# EAGLE design Mux_Shield (EAGLE 9.6.2)
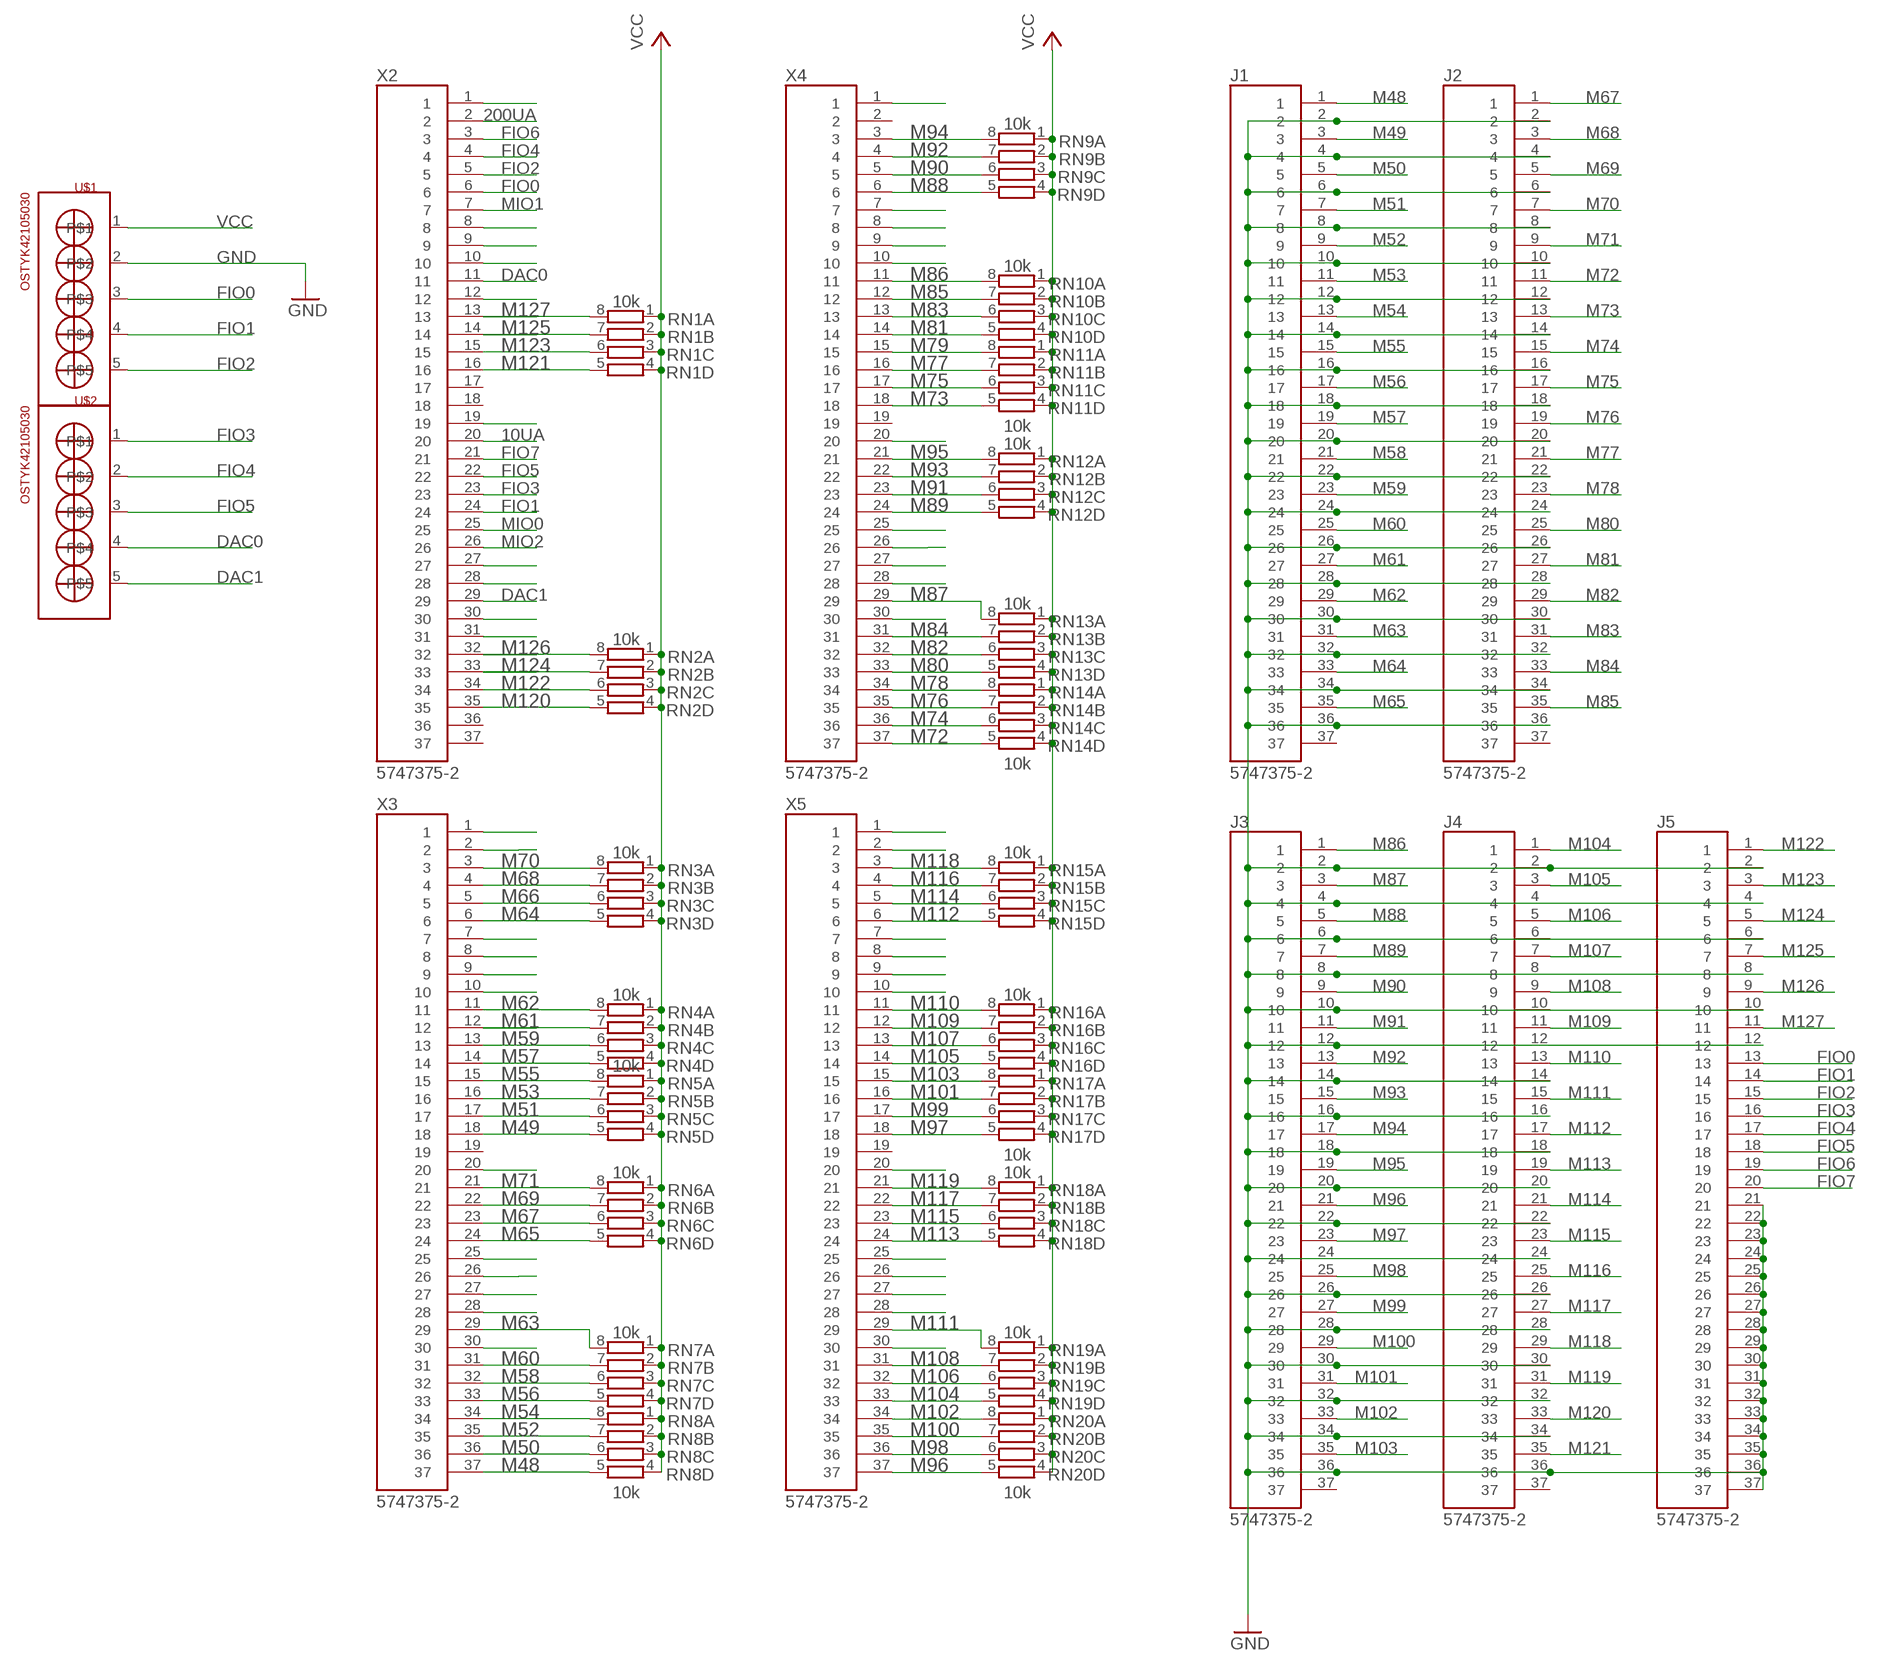
[diagram p0: schematic, sheet 1]

## Parts
J1  5747375-2  [TE_5747375-2]
J2  5747375-2  [TE_5747375-2]
J3  5747375-2  [TE_5747375-2]
J4  5747375-2  [TE_5747375-2]
J5  5747375-2  [TE_5747375-2]
RN1  10k  0016_064R_10K_/_CAY16-103J4LF  [CAY16]
RN2  10k  0016_064R_10K_/_CAY16-103J4LF  [CAY16]
RN3  10k  0016_064R_10K_/_CAY16-103J4LF  [CAY16]
RN4  10k  0016_064R_10K_/_CAY16-103J4LF  [CAY16]
RN5  10k  0016_064R_10K_/_CAY16-103J4LF  [CAY16]
RN6  10k  0016_064R_10K_/_CAY16-103J4LF  [CAY16]
RN7  10k  0016_064R_10K_/_CAY16-103J4LF  [CAY16]
RN8  10k  0016_064R_10K_/_CAY16-103J4LF  [CAY16]
RN9  10k  0016_064R_10K_/_CAY16-103J4LF  [CAY16]
RN10  10k  0016_064R_10K_/_CAY16-103J4LF  [CAY16]
RN11  10k  0016_064R_10K_/_CAY16-103J4LF  [CAY16]
RN12  10k  0016_064R_10K_/_CAY16-103J4LF  [CAY16]
RN13  10k  0016_064R_10K_/_CAY16-103J4LF  [CAY16]
RN14  10k  0016_064R_10K_/_CAY16-103J4LF  [CAY16]
RN15  10k  0016_064R_10K_/_CAY16-103J4LF  [CAY16]
RN16  10k  0016_064R_10K_/_CAY16-103J4LF  [CAY16]
RN17  10k  0016_064R_10K_/_CAY16-103J4LF  [CAY16]
RN18  10k  0016_064R_10K_/_CAY16-103J4LF  [CAY16]
RN19  10k  0016_064R_10K_/_CAY16-103J4LF  [CAY16]
RN20  10k  0016_064R_10K_/_CAY16-103J4LF  [CAY16]
U$1  OSTYK42105030  [OSTYK42105030]
U$2  OSTYK42105030  [OSTYK42105030]
X2  5747375-2  [TE_5747375-2]
X3  5747375-2  [TE_5747375-2]
X4  5747375-2  [TE_5747375-2]
X5  5747375-2  [TE_5747375-2]

## Nets
10UA: X2.20
200UA: X2.2
DAC0: U$2.4 X2.11
DAC1: U$2.5 X2.29
FIO0: J5.13 U$1.3 X2.6
FIO1: J5.14 U$1.4 X2.24
FIO2: J5.15 U$1.5 X2.5
FIO3: J5.16 U$2.1 X2.23
FIO4: J5.17 U$2.2 X2.4
FIO5: J5.18 U$2.3 X2.22
FIO6: J5.19 X2.3
FIO7: J5.20 X2.21
GND: J1.2 J1.4 J1.6 J1.8 J1.10 J1.12 J1.14 J1.16 J1.18 J1.20 J1.22 J1.24 J1.26 J1.28 J1.30 J1.32 J1.34 J1.36 J2.2 J2.4 J2.6 J2.8 J2.10 J2.12 J2.14 J2.16 J2.18 J2.20 J2.22 J2.24 J2.26 J2.28 J2.30 J2.32 J2.34 J2.36 J3.2 J3.4 J3.6 J3.8 J3.10 J3.12 J3.14 J3.16 J3.18 J3.20 J3.22 J3.24 J3.26 J3.28 J3.30 J3.32 J3.34 J3.36 J4.2 J4.4 J4.6 J4.8 J4.10 J4.12 J4.14 J4.16 J4.18 J4.20 J4.22 J4.24 J4.26 J4.28 J4.30 J4.32 J4.34 J4.36 J5.2 J5.4 J5.6 J5.8 J5.10 J5.12 J5.21 J5.22 J5.23 J5.24 J5.25 J5.26 J5.27 J5.28 J5.29 J5.30 J5.31 J5.32 J5.33 J5.34 J5.35 J5.36 J5.37 U$1.2
M48: J1.1 RN8.5 X3.37
M49: J1.3 RN5.5 X3.18
M50: J1.5 RN8.6 X3.36
M51: J1.7 RN5.6 X3.17
M52: J1.9 RN8.7 X3.35
M53: J1.11 RN5.7 X3.16
M54: J1.13 RN8.8 X3.34
M55: J1.15 RN5.8 X3.15
M56: J1.17 RN7.5 X3.33
M57: J1.19 RN4.5 X3.14
M58: J1.21 RN7.6 X3.32
M59: J1.23 RN4.6 X3.13
M60: J1.25 RN7.7 X3.31
M61: J1.27 RN4.7 X3.12
M62: RN4.8 X3.11
M63: J1.31 RN7.8 X3.29
M64: J1.33 RN3.5 X3.6
M65: J1.35 RN6.5 X3.24
M66: RN3.6 X3.5
M67: J2.1 RN6.6 X3.23
M68: J2.3 RN3.7 X3.4
M69: J2.5 RN6.7 X3.22
M70: J2.7 RN3.8 X3.3
M71: J2.9 RN6.8 X3.21
M72: J2.11 RN14.5 X4.37
M73: J2.13 RN11.5 X4.18
M74: J2.15 RN14.6 X4.36
M75: J2.17 RN11.6 X4.17
M76: J2.19 RN14.7 X4.35
M77: J2.21 RN11.7 X4.16
M78: J2.23 RN14.8 X4.34
M79: RN11.8 X4.15
M80: J2.25 RN13.5 X4.33
M81: J2.27 RN10.5 X4.14
M82: J2.29 RN13.6 X4.32
M83: J2.31 RN10.6 X4.13
M84: J2.33 RN13.7 X4.31
M85: J2.35 RN10.7 X4.12
M86: J3.1 RN10.8 X4.11
M87: J3.3 RN13.8 X4.29
M88: J3.5 RN9.5 X4.6
M89: J3.7 RN12.5 X4.24
M90: RN9.6 X4.5
M91: J3.11 RN12.6 X4.23
M92: J3.13 RN9.7 X4.4
M93: J3.15 RN12.7 X4.22
M94: J3.17 RN9.8 X4.3
M95: J3.19 RN12.8 X4.21
M96: J3.21 RN20.5 X5.37
M97: J3.23 RN17.5 X5.18
M98: J3.25 RN20.6 X5.36
M99: J3.27 RN17.6 X5.17
M100: J3.29 RN20.7 X5.35
M101: J3.31 RN17.7 X5.16
M102: J3.33 RN20.8 X5.34
M103: J3.35 RN17.8 X5.15
M104: J4.1 RN19.5 X5.33
M105: J4.3 RN16.5 X5.14
M106: J4.5 RN19.6 X5.32
M107: J4.7 RN16.6 X5.13
M108: J4.9 RN19.7 X5.31
M109: J4.11 RN16.7 X5.12
M110: J4.13 RN16.8 X5.11
M111: J4.15 RN19.8 X5.29
M112: J4.17 RN15.5 X5.6
M113: J4.19 RN18.5 X5.24
M114: J4.21 RN15.6 X5.5
M115: J4.23 RN18.6 X5.23
M116: J4.25 RN15.7 X5.4
M117: J4.27 RN18.7 X5.22
M118: RN15.8 X5.3
M119: J4.31 RN18.8 X5.21
M120: J4.33 RN2.5 X2.35
M121: J4.35 RN1.5 X2.16
M122: J5.1 RN2.6 X2.34
M123: J5.3 RN1.6 X2.15
M124: J5.5 RN2.7 X2.33
M125: J5.7 RN1.7 X2.14
M126: J5.9 RN2.8 X2.32
M127: J5.11 RN1.8 X2.13
MIO0: X2.25
MIO1: X2.7
MIO2: X2.26
N$1: X4.30
N$8: X3.30
N$10: X3.28
N$11: X3.27
N$12: X3.26
N$13: X3.25
N$18: X3.20
N$30: X3.10
N$31: X3.9
N$32: X3.8
N$33: X3.7
N$38: X3.2
N$39: X3.1
N$45: X2.31
N$46: X2.30
N$48: X2.28
N$49: X2.27
N$57: X2.19
N$63: X2.12
N$66: X2.10
N$67: X2.9
N$68: X2.8
N$74: J1.29
N$75: X2.1
N$85: J3.9
N$86: X4.28
N$87: X4.27
N$88: X4.26
N$89: X4.25
N$94: X4.20
N$104: X4.10
N$105: X4.9
N$106: X4.8
N$107: X4.7
N$113: X4.1
N$122: X5.30
N$124: X5.28
N$125: X5.27
N$126: X5.26
N$127: X5.25
N$131: J4.29
N$132: X5.20
N$142: X5.10
N$143: X5.9
N$144: X5.8
N$145: X5.7
N$150: X5.2
N$151: X5.1
VCC: RN1.1 RN1.2 RN1.3 RN1.4 RN2.1 RN2.2 RN2.3 RN2.4 RN3.1 RN3.2 RN3.3 RN3.4 RN4.1 RN4.2 RN4.3 RN4.4 RN5.1 RN5.2 RN5.3 RN5.4 RN6.1 RN6.2 RN6.3 RN6.4 RN7.1 RN7.2 RN7.3 RN7.4 RN8.1 RN8.2 RN8.3 RN8.4 RN9.1 RN9.2 RN9.3 RN9.4 RN10.1 RN10.2 RN10.3 RN10.4 RN11.1 RN11.2 RN11.3 RN11.4 RN12.1 RN12.2 RN12.3 RN12.4 RN13.1 RN13.2 RN13.3 RN13.4 RN14.1 RN14.2 RN14.3 RN14.4 RN15.1 RN15.2 RN15.3 RN15.4 RN16.1 RN16.2 RN16.3 RN16.4 RN17.1 RN17.2 RN17.3 RN17.4 RN18.1 RN18.2 RN18.3 RN18.4 RN19.1 RN19.2 RN19.3 RN19.4 RN20.1 RN20.2 RN20.3 RN20.4 U$1.1
Unconnected: J1.37 J2.37 J3.37 J4.37 X2.17 X2.18 X2.36 X2.37 X3.19 X4.2 X4.19 X5.19

## Library data of the parts
J1-J5 X2-X5 = db37:5747375-2: onn D-Subminiature PIN 37 POS 2.77mm Solder ST Thru-Hole 37 Terminal 1 Port Tube; COMMENT: 5747375-2; DESCRIPTION: D-SUB pin strip 180 ° Number of pins: 37 Print TE Connectivity AMPLIMITE HD-20 1 pc(s); DIGI-KEY_PART_NUMBER: A34071-ND; EU_ROHS_COMPLIANCE: Compliant; MF: TE Connectivity; MP: 5747375-2; PACKAGE: None; PURCHASE-URL: https://pricing.snapeda.com/search/part/5747375-2/?ref=eda
RN1-RN20 = Resistenze:0016_064R_10K_/_CAY16-103J4LF: 10K 064 R; CASE: SMD_3,2x1,6; MONTHLY_USAGE: _____; PART_NUMBER: 064R_10K_/_CAY16-103J4LF; PRICE: _____; SUPPLIER: _____; TYPE: Resistenze
U$1 U$2 = OSTYK42105030:OSTYK42105030: Check availability <https://pricing.snapeda.com/parts/OSTYK42105030/On%20Shore%20Technology%20Inc./view-part?ref=eda>; AVAILABILITY: In Stock; DESCRIPTION: 5 Circuit 0.325 (8.26mm) Barrier Block Connector, Screws with Captive Plate; MF: On Shore Technology Inc.; MP: OSTYK42105030; PACKAGE: None; PRICE: None; PURCHASE-URL: https://pricing.snapeda.com/search/part/OSTYK42105030/?ref=eda

## Board
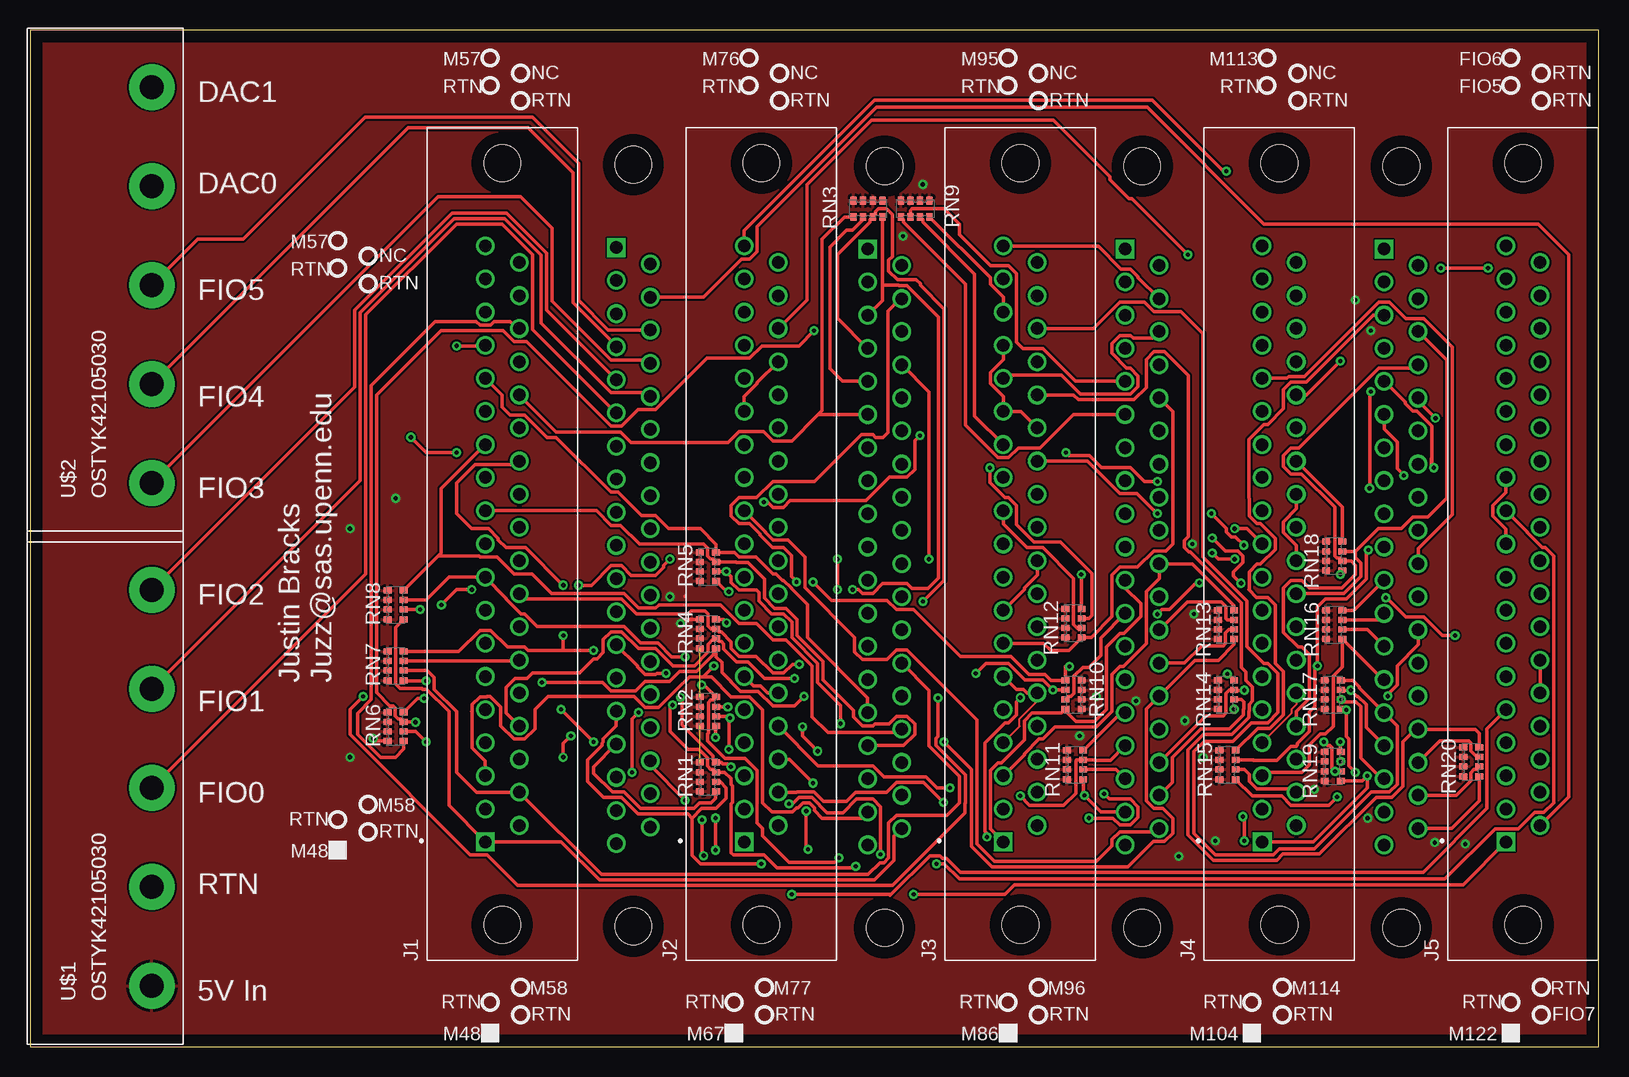
[diagram p1: board, top side]
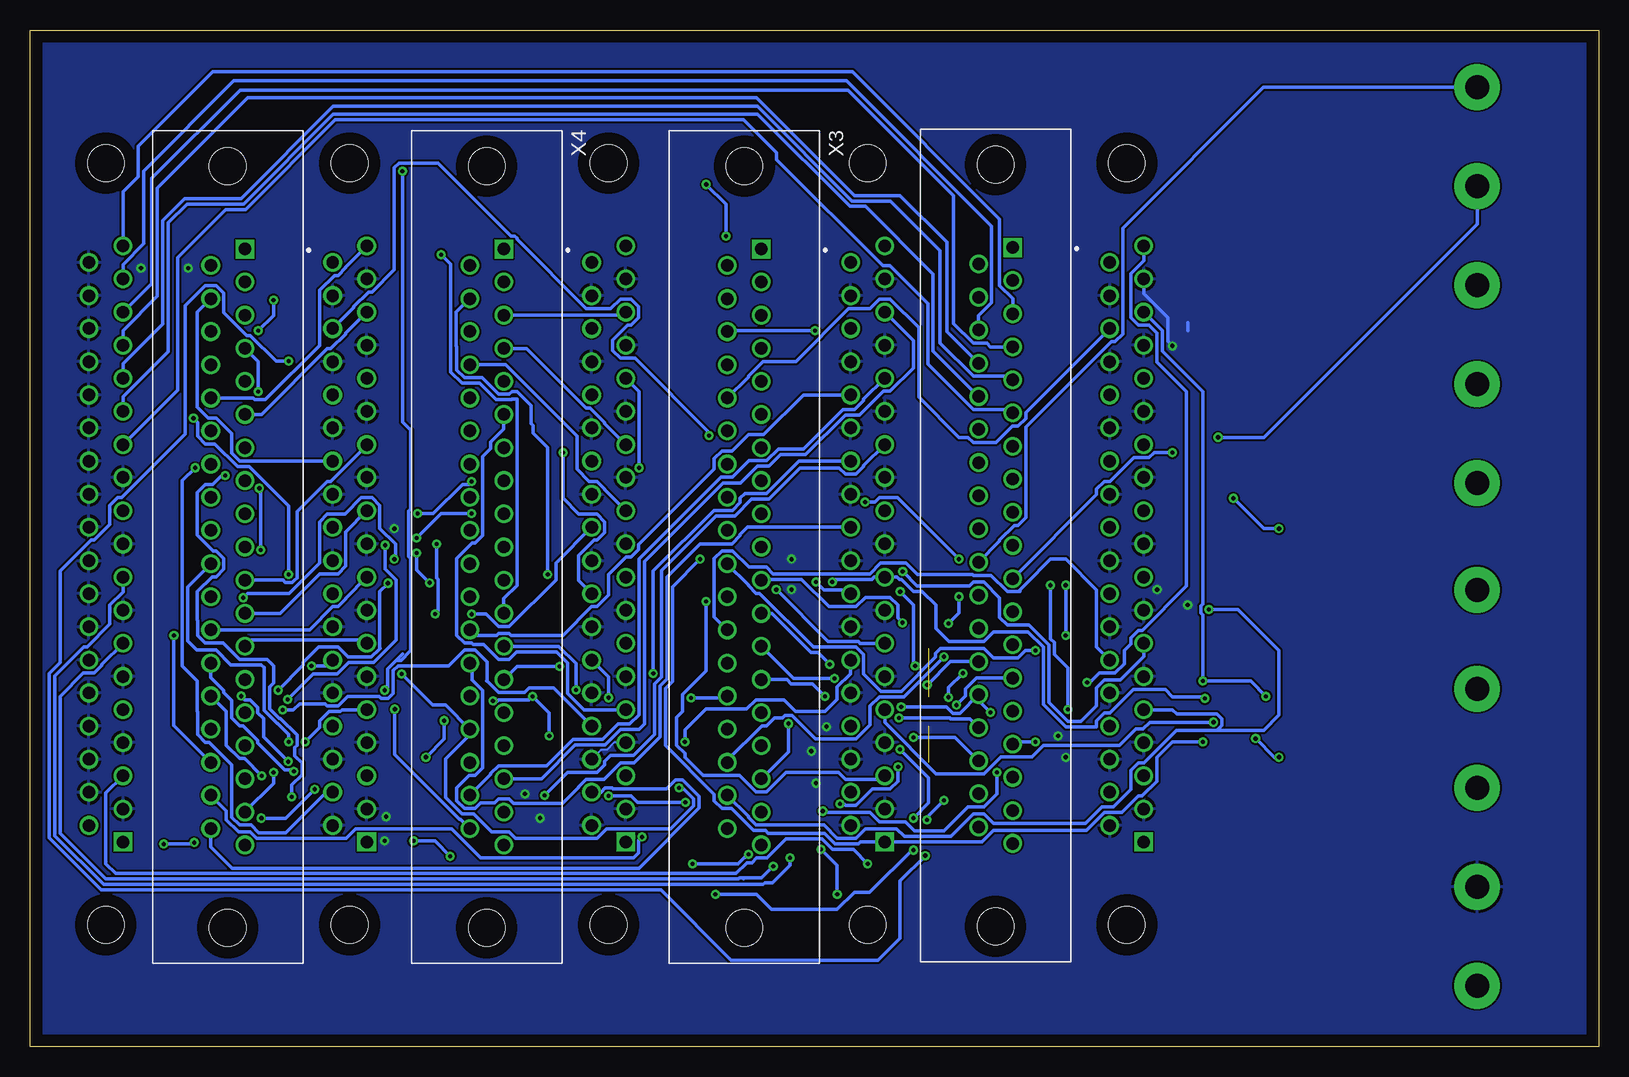
[diagram p2: board, bottom side, seen from below]

Size 130.79 x 84.76 mm. Coordinates in mm from the lower left corner, seen from the top.
Outline: 0,0 130.79,0 130.79,84.76 0,84.76 0,0
Copper layers (1*16): Top 0.035mm / dielectric 1.5mm / Bottom 0.035mm
Design rules "default": minimum track width 6mil, minimum drill 0.35mm, track to track 6mil, track to pad 6mil, pad to pad 6mil, via to via 6mil, smd to smd 6mil, copper to edge 40mil, drill to drill 6mil, minimum pad ring 10mil, minimum via ring 8mil, stop-mask expansion 4mil, vias tented up to drill 0mil, thermal gap 10mil

### Footprints (pad centres in the part's own frame; a part is rotated, then mirrored left to right if it is on the bottom)
TE_5747375-2 = drill 1.04 square: 1 -24.84,1.42 | drill 1.04: 2 -22.1,1.42; 3 -19.33,1.42; 4 -16.56,1.42; 5 -13.82,1.42; 6 -11.05,1.42; 7 -8.28,1.42; 8 -5.54,1.42; 9 -2.77,1.42; 10 0,1.42; 11 2.77,1.42; 12 5.54,1.42; 13 8.28,1.42; 14 11.05,1.42; 15 13.82,1.42; 16 16.56,1.42; 17 19.33,1.42; 18 22.1,1.42; 19 24.84,1.42; 20 -23.47,-1.42; 21 -20.7,-1.42; 22 -17.96,-1.42; 23 -15.19,-1.42; 24 -12.42,-1.42; 25 -9.68,-1.42; 26 -6.91,-1.42; 27 -4.14,-1.42; 28 -1.4,-1.42; 29 1.4,-1.42; 30 4.14,-1.42; 31 6.91,-1.42; 32 9.68,-1.42; 33 12.42,-1.42; 34 15.19,-1.42; 35 17.96,-1.42; 36 20.7,-1.42; 37 23.47,-1.42 | hole 3.05: -31.75,0; 31.75,0
CAY16 = smd 0.5 x 0.65: 1 -1.2,-0.675; 2 -0.4,-0.675; 3 0.4,-0.675; 4 1.2,-0.675; 5 1.2,0.675; 6 0.4,0.675; 7 -0.4,0.675; 8 -1.2,0.675
OSTYK42105030 = drill 2 pad 3.81: 1 -16.51,0; 2 -8.26,0; 3 -0.01,0; 4 8.24,0; 5 16.49,0

### Placement (x,y rotation side)
J1  39.37,41.91 90 top
J2  60.96,41.91 90 top
J3  82.55,41.91 90 top
J4  104.14,41.91 90 top
J5  124.46,41.91 90 top
RN1  56.52,22.48 270 top
RN2  56.52,27.94 270 top
RN3  69.85,69.85 180 top
RN4  56.52,34.42 270 top
RN5  56.52,40.01 270 top
RN6  30.48,26.67 270 top
RN7  30.48,31.75 270 top
RN8  30.48,36.83 270 top
RN9  73.79,69.85 180 top
RN10  87,29.34 90 top
RN11  87.12,23.49 270 top
RN12  87,35.31 270 top
RN13  99.69,35.18 270 top
RN14  99.69,29.34 270 top
RN15  99.82,23.49 270 top
RN16  108.71,35.18 270 top
RN17  108.58,29.34 270 top
RN18  108.71,40.89 270 top
RN19  108.58,23.37 270 top
RN20  120.14,23.75 270 top
U$1  10.16,21.59 90 top
U$2  10.16,63.5 90 top
X2  50.29,41.78 270 bottom
X3  71.25,41.66 270 bottom
X4  92.71,41.66 270 bottom
X5  114.3,41.66 270 bottom

### Tracks (layer width: path | path; a pad name or v marks a point on that pad's centre or on a via)
DAC0  (via drill 0.35)
  Top 0.305: v35.56,49.53 33.02,49.53 v31.75,50.8
  Bottom 0.305: X2.11 41.88,46.01 41.88,46.5 41.24,47.14 40.75,47.14 38.78,49.11 37.5,49.11 37.08,49.53 v35.56,49.53 | v31.75,50.8 27.94,50.8 10.16,68.58 U$2.4
DAC1
  Bottom 0.305: X2.29 49.96,42.14 49.96,42.23 48.72,43.47 48.42,43.47 47.79,44.1 47.79,51.64 40.64,58.79 40.34,58.79 39.7,59.42 39.7,68.25 27.96,79.99 U$2.5
FIO0
  Top 0.305: X2.6 41.91,59.8 41.91,66.04 39.37,68.58 35.56,68.58 27.99,61.01 27.99,39.41 U$1.3
  Bottom 0.305: J5.13 118.49,54.74 118.49,65.79 114.48,69.8 112.81,69.8 105.34,77.27 71.3,77.27 68.55,74.52 68.55,73.96 59.69,65.09 59.09,65.09 55.96,61.96 55.96,56.91 52.16,53.12 49.16,53.12 X2.6
FIO1
  Top 0.305: X2.24 51.4,54.52 48.42,54.52 42.62,60.32 42.62,65.97 39.56,69.04 35.37,69.04 27.53,61.2 27.53,47.2 U$1.4
  Bottom 0.305: X2.24 55.5,57.99 55.5,64.39 61.16,70.05 62.45,70.05 70.13,77.72 105.53,77.72 113,70.25 117.7,70.25 119.28,68.68 119.28,57.96 123.04,54.2 J5.14
FIO2
  Top 0.305: X2.5 43.08,61.4 43.08,66.16 39.75,69.49 35.18,69.49 27.08,61.39 27.08,55 U$1.5
  Bottom 0.305: J5.15 123.04,56.94 119.74,60.24 119.74,68.87 117.89,70.71 113.18,70.71 105.51,78.39 70.14,78.39 62.27,70.51 59.08,70.51 54.94,66.37 54.94,58.67 52.16,55.89 49.16,55.89 X2.5
FIO3
  Top 0.305: X2.23 51.43,57.26 48.42,57.26 43.54,62.15 43.54,68.22 40.89,70.87 34.04,70.87 U$2.1
  Bottom 0.305: X2.23 54.36,59.62 54.36,67.06 58.27,70.97 62.08,70.97 70.23,79.12 112.65,79.12 120.19,71.58 120.19,62.55 123.04,59.71 J5.16
FIO4
  Top 0.305: X2.4 48.87,58.43 45.26,62.04 45.26,72.85 41.5,76.61 31.53,76.61 U$2.2
  Bottom 0.305: J5.17 120.65,63.63 120.65,72.39 113.28,79.76 62.62,79.76 53.8,70.93 53.8,60.29 52.16,58.66 51.04,58.66 50.72,58.34 X2.4
FIO5
  Top 0.305: X2.22 48.21,59.74 45.72,62.23 45.72,73.66 41.91,77.47 27.93,77.47 17.77,67.31 13.98,67.31 U$2.3
  Bottom 0.305: J5.18 123.04,65.22 121.31,66.95 121.31,73 113.79,80.52 62.74,80.52 50.63,68.41 50.63,62.03 51.71,60.95 X2.22
FIO6
  Bottom 0.305: J5.19 123.04,71.27 121.77,72.54 121.77,75.08 115.57,81.28 62.23,81.28 49.96,69.01 49.96,63.43 48.87,62.35 X2.3
FIO7
  Top 0.305: X2.21 56.13,62.48 59.31,65.66 59.99,65.66 60.62,66.3 60.62,68.37 70.56,78.31 93.14,78.31 102.87,68.58 125.73,68.58 128.27,66.04 128.27,20.83 J5.20
GND  (via drill 0.35)
  Top 0.178: J4.24 105.56,28.51 105.17,28.12 105.17,27.8 J4.4 | J3.4 82.49,26.71 82.49,27.33 83.82,28.66 83.82,29.49
  Top 0.305: J2.24 61.49,29.49 60.89,30.09 60.31,30.09 J2.6 | J3.8 82.89,38.12 82.89,38.22 83.97,39.3 J3.28 | v35.56,58.42 37.9,58.42 J1.16 | J4.10 101.45,43.18 v100.42,43.18 | J4.28 105.56,41.78 104.47,42.86 104.47,43.76 105.56,44.84 J4.30 | v34.29,36.83 35.56,38.1 v36.83,38.1 | v67.31,38.1 v67.31,40.64 | J3.32 82.6,52.96 J3.14 81.13,54.2 80.05,55.28 80.05,56.18 81.13,57.26 J3.16 | J3.24 83.82,29.49 83.12,29.49 82.83,29.77 82.22,29.77 J3.6 | v88.27,19.05 90.26,19.05 90.84,18.47 91.74,18.47 92.38,19.11 92.38,20 91.74,20.64 89.98,20.64 v89.53,21.08 | v101.22,17.14 101.22,19.05 v101.09,19.18 | v44.45,24.13 44.45,25.27 v45.09,25.91 | v65.66,24.64 64.39,25.91 v64.39,26.67 | v121.54,64.9 v117.6,64.9 | J2.34 60.62,55.34 60.62,55.28 59.54,54.2 J2.14 | v65.28,21.97 63.3,23.95 J2.22 | J5.10 123.04,43.15 121.95,44.23 121.95,45.13 123.04,46.21 J5.12 | J5.24 J5.25
  Bottom 0.178: J3.4 82.11,25.35 82.7,24.75 83.17,24.75 J3.22
  Bottom 0.305: 34.29,60.35 34.29,59.69 | v35.56,58.42 35.95,58.81 35.95,60.78 37.95,62.77 J1.18
  pour Bottom: -3.81,88.9 133.35,88.9 133.35,-3.81 -3.81,-3.81
M48
  Top 0.305: RN8.5 30.48,34.95 30.48,30.22 30.85,29.84 32.69,29.84 32.74,29.8 33.06,29.8 34.93,27.93 34.93,20.09 J1.1 44.28,17.07 47.46,13.89 70.39,13.89 72.04,15.55 72.04,17.56 X3.37
M49  (via drill 0.35)
  Top 0.305: J1.3 37.95,23.82 36.87,24.9 36.87,27.9 36.83,27.94 36.87,27.97 36.87,28.54 37.5,29.17 38.06,29.17 38.1,29.21 38.36,29.21 39.25,28.33 39.25,26.73 40.34,25.63 41.24,25.63 42.09,26.49 42.09,28.12 43.18,29.21 44.78,29.21 44.8,29.19 50.35,29.19 51.26,28.28 52.41,28.28 53.54,29.41 53.94,29.81 54.97,30.84 56.11,30.84 | v58.25,37.93 58.06,37.93 RN5.5 | 56.11,30.84 56.79,30.84 58.45,29.17 59.99,29.17 61.08,28.08 61.08,20.32 61.85,19.56 63.55,19.56 63.91,19.91 64.02,19.91 64.42,20.32 64.99,20.32 65.39,19.92 65.39,19.7 66.04,19.05 69.32,19.05 X3.18 | v57,31.73 56.11,30.84
  Bottom 0.305: v58.25,37.93 57.15,36.83 57.15,31.88 v57,31.73
M50  (via drill 0.35)
  Top 0.305: v32.51,36.45 31.17,36.45 RN8.6
  Bottom 0.305: J1.5 35.56,28.09 35.2,27.73 31.85,27.73 31.45,27.33 31.45,26.77 31.85,26.37 | 31.85,26.37 35.24,26.37 37.94,23.66 38.4,23.66 39.04,23.03 39.04,21.43 40.48,19.98 41.43,19.98 42.81,18.6 50.46,18.6 51.26,19.4 52.16,19.4 54.03,17.53 57.91,17.53 58.54,18.16 61.13,18.16 61.93,17.36 63.5,17.36 64.62,18.47 70.28,18.47 70.91,19.11 70.91,19.2 X3.36 | v32.51,36.45 30.1,36.45 26.67,33.02 26.67,27.64 27.94,26.37 31.85,26.37
M51  (via drill 0.35)
  Top 0.305: RN5.6 58.02,39.61 v58.04,39.62 58.45,39.21 58.45,38.69 59.09,38.05 60.55,38.05 60.76,37.85 60.76,37.16 61.83,36.09 62.83,36.09 63.5,35.41 63.5,34.1 65.66,31.94 65.66,30.37 67.56,28.47 v67.56,26.92
  Bottom 0.305: v58.04,39.62 56.83,38.42 52.47,38.42 52.16,38.73 51.26,38.73 49.96,37.42 49.96,35.79 49.32,35.16 47.52,35.16 45.85,33.49 45.85,28.72 44.26,27.13 43.18,27.13 41.91,28.4 41.91,29.9 41.24,30.57 39.91,30.57 37.95,32.54 J1.7 | v67.56,26.92 67.56,24.59 X3.17
M52  (via drill 0.35)
  Top 0.305: RN8.7 33.02,37.23 34.93,39.14 J1.9 39.7,37.39 39.7,37.32 40.94,36.09 41.24,36.09 42.28,35.05 49.51,35.05 50.91,33.65 52.35,33.65 53.49,32.51 v54.61,32.51
  Bottom 0.305: v54.61,32.51 57.94,29.17 59.99,29.17 60.76,28.4 60.76,26.81 61.93,25.63 65.31,25.63 67.28,27.61 67.85,27.61 68.07,27.39 68.74,27.39 69.38,26.75 69.77,26.75 72.67,23.85 X3.35
M53
  Top 0.305: J1.11 47.21,44.68 48.42,43.47 49.24,43.47 50.8,41.91 56.14,41.91 56.47,41.58 56.47,40.92 56.74,40.65 56.95,40.65 RN5.7 58.86,40.41 58.9,40.37 59.85,40.37 61.21,39 61.21,37.4 62.07,36.54 63.02,36.54 63.96,35.6 63.96,34.29 66.12,32.13 66.12,30.56 68.66,28.02 68.66,27.47 68.74,27.39 69.02,27.11 69.38,26.75 70.28,26.75 70.45,26.92 71.59,26.92 72.22,27.55 73.12,27.55 73.75,26.91 73.75,26.02 72.83,25.1 X3.16
M54
  Top 0.305: 34.03,40.9 34.29,41.16 34.29,46.53 J1.13 | 34.03,40.9 RN8.8 | 34.03,40.9 37.42,40.9 37.5,40.83 38.94,40.83 40.34,39.43 41.86,39.43 43.5,37.79 49.51,37.79 50.74,36.56 52.16,36.56 52.43,36.83 57.55,36.83 59.09,35.29 60.56,35.29 61.93,33.91 63.04,33.91 65.2,31.75 65.2,27.51 66.53,26.18 72.38,26.18 X3.34
M55
  Top 0.305: J1.15 39.37,54.31 39.37,53.34 40.04,52.68 41.24,52.68 43.11,50.8 43.86,50.8 48.42,46.24 49.01,46.24 50.98,44.27 52.16,44.27 53.25,43.18 55.88,43.18 57.19,41.87 RN5.8 58.71,41.21 59.09,40.83 60.53,40.83 61.93,39.43 62.17,39.43 62.75,38.86 62.83,38.86 63.47,38.22 63.47,38.2 64.8,36.86 64.8,34.09 69.83,29.07 X3.15
M56  (via drill 0.35)
  Top 0.305: v33.02,30.48 31.23,30.48 RN7.5 | v75.69,29.08 75.69,25.86 75.52,25.68 75.52,25.12 77.98,22.66 77.98,20.32 77.93,20.27 77.93,19.48 71.88,13.44 40.65,13.44 38.1,15.99 36.71,15.99 26.67,26.02 26.67,28.11 v27.77,29.21
  Bottom 0.305: v27.77,29.21 29.04,30.48 v33.02,30.48 33.02,35.99 33.2,36.17 33.2,36.73 33.02,36.91 33.02,54.61 36.41,58 36.41,59.7 J1.17 | v75.69,29.08 72.82,29.08 X3.33
M57  (via drill 0.35)
  Top 0.305: v42.67,30.35 47.72,30.35 48.42,29.65 50.46,29.65 51.26,30.45 53.31,30.45 54.15,31.29 55.57,31.29 56.97,32.7 56.97,33 RN4.5 57.19,32.5 57.68,32.01 57.68,31.22 58.45,30.45 58.45,30.41 59.23,29.63 60.7,29.63 61.93,28.4 63.72,28.4 v64.52,29.21
  Bottom 0.305: v42.67,30.35 42.42,30.35 41.63,31.14 40.34,31.14 39.57,31.91 39.57,33.02 39.04,33.56 39.04,34.08 38.4,34.72 38.07,34.72 34.4,38.39 34.4,54.61 36.87,57.08 36.87,59.51 37.51,60.16 38.4,60.16 39.04,60.79 39.04,64.46 37.95,65.54 J1.19 | v64.52,29.21 65.56,30.25 67.35,30.25 67.7,30.61 X3.14
M58
  Top 0.305: RN7.6 33.12,31.35 33.7,30.76 33.7,29.8 35.56,27.94 35.56,22.86 37.21,21.21 J1.21 47.65,14.35 69.85,14.35 70.84,15.34 71.18,15.34 71.58,15.74 71.58,18.63 72.22,19.27 76.42,19.27 77.47,20.32 77.47,22.52 74.93,25.06 74.93,29.71 X3.32
M59  (via drill 0.35)
  Top 0.305: J1.23 39.7,27.8 39.7,29.94 40.44,30.68 41.44,30.68 41.91,31.14 45.8,31.14 46.99,32.34 47.27,32.34 47.79,32.85 47.79,33.95 48.42,34.59 49.32,34.59 50.72,33.19 52.16,33.19 53.6,31.75 55.38,31.75 56.52,32.89 56.52,33.55 56.98,34.02 RN4.6 57.44,33.77 57.64,33.77 57.82,33.59 57.82,33.17 58.9,32.09 59.85,32.09 61.25,30.69 63.02,30.69 63.04,30.71 v63.73,30.71
  Bottom 0.305: X3.13 67.16,30.71 v63.73,30.71
M60
  Top 0.305: RN7.7 40.71,32.15 J1.25
  Bottom 0.305: X3.31 73.75,35.83 73.75,40.71 73.12,41.34 72.22,41.34 70.85,39.97 69.38,39.97 68.83,39.43 60.79,39.43 59.91,40.31 57.76,40.31 56.82,39.37 52.23,39.37 52.16,39.3 50.69,39.3 49.32,37.93 48.26,37.93 48.26,38.09 47.79,38.56 47.79,38.57 45.72,40.64 44.45,40.64 41.88,38.07 41.88,33.31 J1.25
M61  (via drill 0.35)
  Top 0.305: J1.27 41.23,37.33 49.32,37.33 50.58,36.07 54.86,36.07 55.12,36.32 56.26,36.32 56.52,36.07 56.52,35.05 56.75,34.82 RN4.7 57.44,34.57 57.64,34.57 58.45,33.76 58.45,33.18 59.09,32.55 60.53,32.55 61.93,31.14 62.83,31.14 63.55,31.86 v64.12,31.86
  Bottom 0.305: v64.12,31.86 65.12,32.86 65.68,32.86 68.94,36.12 X3.12
M62  (via drill 0.35)
  Top 0.305: RN4.8 57.79,35.62 v58.07,35.34
  Bottom 0.305: v58.07,35.34 58.45,35.72 58.45,36.82 59.09,37.46 61.16,37.46 61.93,36.69 64.19,36.69 66.48,38.97 69.75,38.97 X3.11
M63  (via drill 0.35)
  Top 0.305: RN7.8 35.74,32.95 37.5,34.72 38.4,34.72 39.8,33.31 41.24,33.31 41.53,33.02 44.45,33.02 | 44.45,33.02 v46.99,33.02 | v44.45,34.29 44.45,33.02 | J1.31 40.51,48.54 37.5,48.54 37.11,48.54 36.83,48.26 35.56,46.99 35.56,44.45 36.83,43.18 38.21,43.18 39.04,42.36 39.04,42.25 39.69,41.59 41.32,41.59 v44.45,38.47
  Bottom 0.305: v46.99,33.02 47.82,33.02 48.42,32.42 50.49,32.42 51.26,33.19 54.89,33.19 55.29,32.79 55.29,32.47 58.13,29.63 59.85,29.63 61.3,31.08 61.3,32.68 61.93,33.31 65.49,33.31 69.98,37.8 70.28,37.8 70.91,38.44 70.91,38.5 X3.29 | v44.45,38.47 v44.45,34.29
M64
  Top 0.305: J1.33 43.86,51.26 49.21,51.26 50.09,50.38 58.19,50.38 59.09,51.28 61.16,51.28 61.93,50.51 63.5,50.51 65.55,52.56 65.7,52.71 | RN3.5 67.91,69.17 66.04,67.31 66.04,53.05 65.7,52.71 | X3.6 65.7,52.71
M65
  Top 0.305: RN6.5 31.16,24.8 30.48,24.13 29.21,24.13 27.3,26.04 27.3,27.78 28.45,28.93 28.45,52.07 28.45,52.58 28.45,55.12 33.78,60.45 36.32,60.45 37.2,60.45 37.5,60.16 38.4,60.16 38.7,60.45 40.01,60.45 40.59,59.87 J1.35
  Bottom 0.305: X3.24 70.91,55.83 70.91,55.93 69.71,57.13 66.95,57.13 62.56,61.53 60.79,61.53 59.99,62.33 59.09,62.33 56.69,59.93 56.69,54.15 53.34,50.8 52.58,50.8 52.16,50.38 50.28,50.38 48.91,51.75 48.42,51.75 47.79,52.38 47.79,52.87 J1.35
M66
  Top 0.305: X3.5 67.71,55.48 66.67,56.52 66.67,66.67 68.07,68.07 68.58,68.07 69.45,68.94 RN3.6
M67  (via drill 0.35)
  Top 0.305: RN6.6 32.15,26.27 v33.02,25.4 | v74.93,40.64 74.93,54.58 X3.23
  Bottom 0.305: v33.02,25.4 35.56,25.4 36.87,24.09 36.87,22.13 38.1,20.9 38.1,20.89 38.4,20.89 39.77,19.52 41.24,19.52 42.74,18.03 50.46,18.03 51.42,17.07 J2.1 61.57,17.07 61.74,16.9 63.69,16.9 64.57,17.78 69.26,17.78 69.49,18.01 70.47,18.01 72.32,19.87 73.12,19.87 73.75,20.51 73.75,21.04 77.83,25.11 77.83,29.87 77.24,30.45 77.24,38.33 v74.93,40.64
M68  (via drill 0.35)
  Top 0.305: X3.4 67.31,60.73 67.31,66.04 69.81,68.55 69.83,68.55 70,68.72 70,68.93 RN3.7 70.5,69.42 70.5,69.63 70.72,69.85 71.38,69.85 71.88,69.35 71.88,65.88 71.58,65.58 71.58,64.68 72.3,63.96 73.85,63.96 74.21,63.6 74.21,63.5 76.2,61.51 76.2,38.88 v74.44,37.11
  Bottom 0.305: v74.44,37.11 74.44,31.31 76.38,29.37 76.38,27.94 76.88,27.43 76.88,25.12 76.2,24.43 76.2,24.13 74.68,22.61 71.65,22.61 70.28,21.24 69.38,21.24 67.76,22.86 63.39,22.86 62.83,22.29 59.83,22.29 J2.3
M69  (via drill 0.35)
  Top 0.305: v32.13,27.05 32.11,27.07 RN6.7 30.91,27.31 30.7,27.31 30.44,27.58 30.44,28.25 30.26,28.42 30,28.42 28.91,29.51 28.91,54.3 34.29,59.69 39.44,59.69 40.34,58.79 41.39,58.79 48.42,51.75 49.32,51.75 50.69,53.12 52.16,53.12 56.43,57.39 59.99,57.39 61.02,58.42 64.09,58.42 v65.36,59.69
  Bottom 0.305: v32.13,27.05 37.45,27.05 38.01,26.5 38.59,26.5 39.96,25.13 46.3,25.13 47.29,24.14 49.86,24.14 51.26,22.74 55.25,22.74 59.54,27.03 J2.5 | v65.36,59.69 72.59,59.69 X3.22
M70  (via drill 0.35)
  Top 0.305: X3.3 71.05,62.21 71.05,63.5 | 71.05,63.5 RN3.8 | 71.05,63.5 72.39,63.5 72.45,63.44 73.12,63.44 75.74,60.81 75.74,39.07 74.85,38.18 73.54,38.18 73.12,38.6 71.08,38.6 70.28,37.8 69.38,37.8 69.08,38.1 v68.58,38.1
  Bottom 0.305: J2.7 61.6,33.63 61.74,33.77 64.25,33.77 v68.58,38.1
M71  (via drill 0.35)
  Top 0.305: RN6.8 32.32,29.04 v32.85,29.04 | v63.91,38.74 63.47,39.19 63.47,40.96 62.83,41.59 61.91,41.59 60.84,42.67 60.84,42.73 59.98,43.59 59.09,43.59 58.45,44.23 58.45,45.13 59.09,45.77 60.56,45.77 61.93,47.14 65.41,47.14 69.3,51.02 70.28,51.02 70.5,50.8 71.12,50.8 71.5,51.18 71.5,61.34 72.52,62.36 X3.21
  Bottom 0.305: v32.85,29.04 33.02,29.21 33.05,29.17 35.56,29.17 36.16,29.77 38.8,29.77 40.01,28.57 40.26,28.32 40.78,27.8 41.24,27.8 41.88,27.17 41.88,26.7 41.91,26.67 44.45,26.67 46.31,28.53 46.31,29.8 46.31,33.3 47.59,34.59 50.46,34.59 51.26,33.79 54.19,33.79 55.28,34.88 55.28,36.83 56.42,37.96 57.15,37.96 58.13,38.94 58.32,38.94 58.52,39.14 J2.9 60.43,39.14 60.6,38.97 63.68,38.97 v63.91,38.74
M72  (via drill 0.35)
  Top 0.305: J2.11 61.3,42.93 61.3,42.86 61.93,42.23 63.19,42.23 64.59,40.82 64.59,38.28 68.74,34.13 68.74,32.93 69.38,32.29 71.45,32.29 72.22,33.06 73.12,33.06 78.94,27.23 78.94,16.9 80.4,15.44 88.9,15.44 90.2,16.75 90.2,17.27 90.84,17.9 93.84,17.9 X4.37 | v100.38,28.14 RN14.5
  Bottom 0.305: X4.37 94.9,18.96 94.96,18.96 100.38,24.38 v100.38,28.14
M73  (via drill 0.35)
  Top 0.305: RN11.5 87.8,21.04 v87.88,20.95 89.28,19.56 X4.18
  Bottom 0.305: J2.13 61.3,48.44 61.3,48.37 61.93,47.73 62.83,47.73 63.35,48.26 66.58,48.26 69.19,45.65 70.63,45.65 72.03,44.25 73.6,44.25 78.16,39.69 78.16,30.83 78.74,30.25 78.74,26.02 80.5,24.26 82.42,24.26 82.89,23.79 82.89,23.5 83.53,22.86 85.98,22.86 v87.88,20.95
M74
  Top 0.305: RN14.6 100.95,28.94 100.97,28.96 101.18,28.74 101.18,28.16 101.14,28.13 101.14,27.64 100,26.49 97.61,26.49 95.22,24.09 95.22,22.04 X4.36
  Bottom 0.305: J2.15 61.3,53.98 61.3,53.88 62.04,53.13 63.02,53.13 66.33,49.82 68.41,49.82 69.38,48.85 70.85,48.85 72.22,47.48 73.17,47.48 80.01,40.64 80.01,27.68 80.79,26.89 81.77,26.89 83.06,25.6 85.53,25.6 87.73,23.41 91.74,23.41 92.38,22.77 92.38,22.71 X4.36
M75
  Top 0.305: RN11.6 90.52,23.09 X4.17
  Bottom 0.305: J2.17 57.15,58.85 57.15,56.59 59.09,54.65 59.66,54.65 61.62,52.68 62.83,52.68 66.14,49.36 68.22,49.36 69.19,48.39 70.16,48.39 71.57,46.99 73.01,46.99 79.55,40.45 79.55,26.89 80.01,26.43 81.58,26.43 82.87,25.15 85.34,25.15 88.16,22.33 X4.17
M76  (via drill 0.35)
  Top 0.305: J2.19 59.54,68.02 70.41,78.89 93.57,78.89 99.48,72.98 v99.74,72.98 | v101.22,29.72 100.39,29.72 RN14.7 99.97,29.74 99.69,29.46 99.69,27.81 99.47,27.58 98.02,27.58 X4.35
  Bottom 0.305: 99.74,32.76 100.29,32.21 | v99.74,72.98 99.74,52.07 99.06,51.39 99.06,44.83 99.23,44.66 99.23,40.87 99.06,40.69 99.06,33.02 99.87,32.21 100.29,32.21 | v101.22,29.72 100.99,29.94 100.99,31.5 100.29,32.21
M77  (via drill 0.35)
  Top 0.305: v76.16,20.36 74.48,22.04 72.22,22.04 71.39,21.21 68.82,21.21 68.05,20.44 66.16,20.44 65.37,21.23 63.93,21.23 63.91,21.21 J2.21 | 91.35,25.15 X4.16 90.07,23.88 88.77,23.88 88.75,23.89 RN11.7 87.23,23.89 87.17,23.83 87.17,21.13 86.17,20.12 83.32,20.12 v82.55,20.89
  Bottom 0.305: v76.16,20.36 80.14,20.36 80.68,20.89 v82.55,20.89 82.75,20.89
M78  (via drill 0.35)
  Top 0.305: v76.68,21.56 75.6,21.56 74.67,22.5 71.19,22.5 70.28,23.41 65.69,23.41 J2.23 | RN14.8 100.34,30.54 v99.81,31.07
  Bottom 0.305: v76.68,21.56 76.4,21.56 75.48,20.64 75.48,20.08 77.4,18.16 82.72,18.16 83.52,17.36 90.3,17.36 90.84,17.9 92.31,17.9 93.82,19.41 94.77,19.41 96.13,20.77 96.13,23.97 94.13,25.97 X4.34 96.16,28.49 97.24,28.49 v99.81,31.07
M79
  Top 0.305: RN11.8 90.94,27.84 X4.15
M80  (via drill 0.35)
  Top 0.305: v76.2,25.4 78.49,23.11 78.49,16.71 80.21,14.99 91.52,14.99 93.64,17.1 94.58,17.1 95.25,17.77 95.25,19.05 94.43,19.87 93.68,19.87 93.05,20.51 93.05,28.15 X4.33 97.1,32.21 99.06,32.21 100.37,33.52 RN13.5
  Bottom 0.305: v76.2,25.4 76.2,26.39 74.44,28.15 71.05,28.15 70.28,28.92 67.95,28.92 66.97,27.94 64.52,27.94 63.5,28.96 63.5,29.97 62.38,31.09 J2.25
M81  (via drill 0.35)
  Top 0.305: v65.28,38.73 66.81,37.2 71.45,37.2 72.22,36.43 73.66,36.43 77.55,32.55 81.75,32.55 83.27,31.03 84.61,31.03 85.1,30.54 RN10.5 86.32,31.71 | 86.36,31.75 86.32,31.71 | 86.32,31.71 86.34,31.69 v86.65,31.69
  Bottom 0.305: J2.27 62.67,38.06 64.6,38.06 v65.28,38.73 | v86.65,31.69 90.2,31.69 X4.14
M82
  Top 0.305: X4.32 96.22,31.98 97.67,33.42 99.47,33.42 99.65,33.6 99.65,34.5 99.93,34.78 RN13.6
  Bottom 0.305: J2.29 70.99,43.31 71.58,42.72 71.58,42.61 72.28,41.91 74.93,41.91 77.7,39.14 77.7,30.64 78.28,30.06 78.28,25.83 80.45,23.66 81.58,23.66 82.95,22.29 84.42,22.29 85.06,21.66 85.06,21.62 86.41,20.27 90.47,20.27 90.84,20.64 91.74,20.64 92.06,20.32 93.23,20.32 93.68,19.87 94.58,19.87 95.22,20.51 95.22,21.59 94.19,22.61 93.68,22.61 93.05,23.25 93.05,29.68 93.94,30.58 93.94,31.79 X4.32
M83  (via drill 0.35)
  Top 0.305: RN10.6 v85.28,29.74 85.26,29.74 84.42,30.57 82.95,30.57 81.58,31.95 79.67,31.95 v78.84,31.11
  Bottom 0.305: J2.31 66.67,48.82 69.38,46.11 71.19,46.11 71.58,45.72 71.58,45.35 72.22,44.7 73.79,44.7 78.84,39.65 v78.84,31.11 | v85.28,29.74 85.28,31.94 86.72,33.38 X4.13
M84
  Top 0.305: RN13.7 99.8,35.58 99.69,35.69 99.69,36.71 99.32,37.09 96.47,37.09 X4.31
  Bottom 0.305: J2.33 66.32,54.33 69.63,51.02 70.9,51.02 72.27,49.65 73.12,49.65 73.75,49.02 73.75,48.17 80.05,41.88 80.05,41.46 80.68,40.83 81.09,40.83 82.55,39.37 82.55,37.66 83.52,36.69 83.97,36.69 86.36,34.29 90.67,34.29 90.84,34.46 91.74,34.46 91.91,34.29 93.67,34.29 X4.31
M85  (via drill 0.35)
  Top 0.305: J2.35 64.77,62.26 64.77,71.87 70.14,77.24 85.32,77.24 90.02,72.54 90.02,72.29 91.59,70.71 91.85,70.71 v96.52,66.04 | RN10.7 86.56,29.18 86.77,29.18 87.04,29.45 87.04,30.91 87.75,31.63 88.27,31.63 89.26,32.61 89.26,34.08 X4.12
  Bottom 0.305: 91.32,36.12 X4.12 91.29,37.35 90.2,38.44 90.2,52.04 | 90.2,52.04 90.17,52.07 | 90.2,52.04 90.2,54 90.59,54 90.65,53.93 91.93,53.93 93.3,55.3 94.77,55.3 95.71,56.24 95.71,65.23 v96.52,66.04
M86
  Top 0.305: RN10.8 86.24,28.06 | 86.24,28.06 85.99,27.8 83.52,27.8 82.89,27.17 82.89,25.57 80.98,23.66 80.68,23.66 80.05,23.03 80.05,18.16 J3.1 | X4.11 91.29,38.25 92.59,36.95 92.59,35.88 91.17,34.46 90.84,34.46 89.71,33.33 89.71,28.13 88.71,27.13 87.17,27.13 86.24,28.06
M87
  Top 0.305: J3.3 82.89,24.33 82.89,24.4 84.12,25.63 84.42,25.63 85.27,26.49 85.45,26.67 88.9,26.67 90.17,27.94 90.17,31.02 90.84,31.69 91.14,31.69 93.05,33.6 93.05,37.97 94.13,39.05 X4.29 96.9,40.26 100.37,36.79 RN13.8
M88
  Top 0.305: RN9.5 72.83,68.93 72.83,68.72 77.98,63.58 77.98,51.81 80.68,49.11 81.58,49.11 82.38,49.91 84.2,49.91 87,52.71 X4.6
  Bottom 0.305: J3.5 84.6,28.09 85.96,29.45 85.96,31.98 86.91,32.92 90.21,32.92 90.84,32.29 91.74,32.29 92.97,33.52 93.84,33.52 93.98,33.66 94.58,33.66 95.22,34.3 95.22,40.71 93.95,41.97 93.68,41.97 93.05,42.61 93.05,49.2 92.38,49.87 92.38,50.39 91.29,51.47 X4.6
M89
  Top 0.305: J3.7 84.48,33.63 85.09,33.02 86.58,33.02 RN12.5 88.46,34.11 90.2,35.85 90.2,39.34 90.84,39.97 92.31,39.97 93.68,41.34 94.68,41.34 95.25,41.91 95.25,52.96 X4.24
M90
  Top 0.305: RN9.6 73.39,69.7 73.53,69.85 76.2,69.85 77.47,68.58 77.47,67.69 80.07,65.09 81.58,65.09 82.23,64.45 82.23,58.74 82.78,58.19 84.42,58.19 87.13,55.48 X4.5
M91
  Top 0.305: RN12.6 87.27,34.91 87,35.18 87,39.02 84.42,41.59 83.12,41.59 81.13,43.58 J3.11
  Bottom 0.305: J3.11 82.89,46.44 82.89,46.5 83.52,47.14 84.19,47.14 85.2,48.15 85.2,50.91 90.2,55.91 90.2,55.93 91.13,56.85 X4.23
M92
  Top 0.305: RN9.7 74.43,68.93 74.43,68.72 78.74,64.42 78.74,52.58 J3.13
  Bottom 0.305: J3.13 82.89,51.95 82.89,52.04 84.09,53.25 84.42,53.25 89.39,58.22 X4.4
M93  (via drill 0.35)
  Top 0.305: J3.15 81.38,55.98 85.97,55.98 87.57,54.39 91.74,54.39 92.38,55.03 92.38,55.93 91.74,56.56 91.41,56.56 90.17,57.8 90.17,58.63 90.84,59.3 91.74,59.3 91.98,59.05 93.57,59.05 X4.22 | RN12.7 88.28,35.71 88.52,35.94 88.52,39.45 85.91,42.05 83.68,42.05 82.22,43.52 82.22,45.13 81.58,45.77 81.28,45.77 80.01,47.04 v80.01,48.26
  Bottom 0.305: v80.01,48.26 80.01,54.61 J3.15
M94
  Top 0.305: RN9.8 80.05,64.12 80.05,63.56 81.13,62.48 J3.17
  Bottom 0.305: J3.17 81.38,60.99 X4.3
M95  (via drill 0.35)
  Top 0.305: X4.21 92.38,64.11 92.38,64.2 91.74,64.84 90.95,64.84 89.05,66.75 J3.19 | RN12.8 87.63,36.55 v87.63,39.37
  Bottom 0.305: v87.63,39.37 87.63,49.93 88.83,51.14 88.83,51.78 89.01,51.96 89.01,53.45 90.17,54.61 90.62,54.61 90.84,54.39 91.74,54.39 93.11,55.76 94.58,55.76 95.22,56.4 95.22,58.39 95.25,58.42 95.25,61.24 X4.21
M96
  Top 0.305: X5.37 118.52,18.19 120.82,20.49 RN20.5
  Bottom 0.305: J3.21 83.2,21.21 82.83,21.58 82.27,21.58 82.18,21.49 77.72,21.49 76.97,22.25 76.4,22.25 75.02,20.87 75.02,19.89 80.02,14.88 113.94,14.88 115.72,16.66 X5.37
M97  (via drill 0.35)
  Top 0.305: RN17.5 109.33,28.07 v109.73,28.07 109.73,25.86 109.94,25.64 109.94,23.41 v110.49,22.86
  Bottom 0.305: 92.71,30.48 92.7,30.48 | 92.7,30.48 92.7,32.08 93.68,33.06 94.58,33.06 95.89,31.75 100.1,31.75 100.5,31.35 100.5,30.52 100.54,30.48 100.54,29.43 100.94,29.04 101.5,29.04 101.68,29.21 104.31,29.21 105.11,28.4 106.01,28.4 106.18,28.57 108.33,28.57 108.84,28.07 v109.73,28.07 | X5.18 110.49,21.95 v110.49,22.86 | J3.23 87.14,29.89 89.18,29.89 89.56,29.52 91.74,29.52 92.7,30.48
M98  (via drill 0.35)
  Top 0.305: RN20.6 120.57,23.1 120.37,23.1 120.1,22.83 120.1,22.17 118.88,20.96 X5.36 | v79.76,17.47 79.76,17.79 79.59,17.96 79.59,25.34 81.25,27 81.58,27 82.22,27.64 82.22,28.76 v82.55,29.09
  Bottom 0.305: X5.36 114.42,19.66 114.42,18.92 113.41,17.9 112.43,17.9 111.88,17.36 104.43,17.36 103.63,18.16 95.63,18.16 93.21,15.73 80.48,15.73 80.05,16.16 80.05,17.19 v79.76,17.47 | v82.55,29.09 82.55,30.81 J3.25
M99  (via drill 0.35)
  Top 0.305: X5.17 112.67,22.33 110.92,24.08 110.92,28.35 110.52,28.75 109.45,28.75 RN17.6 v109.31,28.94 | v109.31,28.94 | v101.19,41.8 100.5,42.5 100.14,42.5 99.74,42.9 99.74,43.18 v98.47,44.45 | v86.36,49.53 86.61,49.28 88.32,49.28 89.32,48.28 91.74,48.28 92.91,47.11 v93.98,47.11
  Bottom 0.305: v109.31,28.94 107.18,31.07 105.19,31.07 104.23,32.02 102.14,32.02 100.27,33.9 100.27,38.92 101.19,39.84 v101.19,41.8 | v98.47,44.45 97.17,44.45 94.74,46.88 94.21,46.88 v93.98,47.11 | J3.27 85.06,38.86 85.06,40.96 83.79,42.23 83.52,42.23 82.89,42.86 82.89,43.76 83.52,44.4 83.85,44.4 83.86,44.41 85.05,44.41 86.36,45.72 v86.36,49.53
M100  (via drill 0.35)
  Top 0.305: RN20.7 120.61,24.15 120.1,24.66 120.1,25.32 119.92,25.5 117.53,25.5 X5.35 | v93.98,36.06 94.36,36.43 94.96,36.43 97.2,38.67 v97.47,38.67 | v113.03,37.43 113.26,37.2 113.33,37.2 114.7,35.83 116.17,35.83 117.71,34.29 v118.79,34.29 | v100.42,40.64 99.06,40.64 v98.55,41.15
  Bottom 0.305: v93.98,36.06 92.77,36.06 91.74,35.03 90.84,35.03 86.95,38.93 86.95,40.33 J3.29 | X5.35 118.79,26.77 v118.79,34.29 | v113.03,37.43 112.66,37.8 109.18,37.8 106.64,40.33 106.64,43.76 106.01,44.4 104.54,44.4 103.17,45.77 102.27,45.77 101.63,45.13 101.63,43.22 100.33,41.91 100.33,40.73 v100.42,40.64 | v97.47,38.67 98.55,39.75 v98.55,41.15
M101  (via drill 0.35)
  Top 0.305: v93.98,44.45 93.72,44.71 93.68,44.71 92.28,46.11 90.84,46.11 88.13,48.82 J3.31 | RN17.7 109.28,29.72 v110.11,29.72 110.62,29.21 110.71,29.21 111.38,28.54 111.38,26.6 X5.16 | v98.55,42.42 99.64,41.32 100.71,41.32 101.11,40.92 101.11,40.36 100.33,39.58 100.33,39.26 v100.95,38.63
  Bottom 0.305: v93.98,44.45 96.52,44.45 v98.55,42.42 | 101.7,33.12 102.33,32.48 104.28,32.48 105.11,33.31 106.73,33.31 108.01,32.03 108.01,31.82 v110.11,29.72 | 101.7,33.12 101.6,33.22 | 101.7,33.12 101.63,33.18 101.63,37.95 v100.95,38.63
M102
  Top 0.305: J3.33 86.98,54.33 87.38,53.93 92.03,53.93 93.05,54.95 93.05,57.3 93.68,57.93 94.58,57.93 96.58,55.94 96.58,42.55 96.22,42.19 96.22,41.63 96.62,41.23 96.75,41.23 101,36.97 101,31.61 101.37,31.24 101.37,30.53 101.9,30 101.9,28.81 101.63,28.54 101.63,27.97 101.6,27.94 101.6,27.45 100.18,26.04 97.8,26.04 96.52,24.75 96.52,17.64 98.63,15.53 103.92,15.53 104.44,16.05 107.49,16.05 112.22,20.78 113.52,20.78 114.42,21.69 114.42,25.4 115.49,26.47 X5.34 120.47,26.47 120.82,26.12 RN20.8
M103
  Top 0.305: J3.35 88.64,59.87 90.84,62.07 92.88,62.07 93.68,61.27 95.95,61.27 97.79,59.44 97.79,40.83 101.46,37.16 101.46,33.36 102.87,31.95 103.17,31.95 104.02,31.1 104.02,27.85 103.17,27 101.8,27 100.26,25.47 97.88,25.47 97.03,24.61 97.03,17.78 98.82,15.99 103.63,15.99 104.15,16.51 107.06,16.51 111.79,21.24 113.33,21.24 113.97,21.88 113.97,26.75 X5.15 110.79,29.92 110.79,30 110.26,30.54 RN17.8
M104  (via drill 0.35)
  Top 0.305: J4.1 105.97,17.07 106.97,17.07 111.47,21.56 v111.47,22.57 111.07,22.17 RN19.5
  Bottom 0.305: X5.33 114.42,27.94 114.42,25.1 113.33,24.01 112.91,24.01 v111.47,22.57
M105
  Top 0.305: X5.14 112.76,30.61 RN16.5 109.39,31.67 108.63,30.91 108.63,26.71 108,26.08 107.57,26.08 106.64,25.16 106.64,23.5 106.01,22.86 103,22.86 J4.3
M106  (via drill 0.35)
  Top 0.305: RN19.6 108.81,22.97 v108.79,22.95 108.54,23.2 108.54,24.94 108.36,25.12 108.13,25.12 v107.85,25.4
  Bottom 0.305: v108.79,22.95 108.93,23.08 109.54,23.08 111.8,25.34 111.8,25.54 113,26.75 113.33,26.75 113.97,27.39 113.97,28.88 114.63,29.54 114.63,29.68 115.72,30.77 X5.32 | v107.85,25.4 106.64,26.61 106.64,27.17 105.87,27.95 104.92,27.95 104.78,28.09 J4.5
M107
  Top 0.305: RN16.6 111.48,34.78 X5.13
  Bottom 0.305: X5.13 112.34,33.91 103,33.91 J4.7
M108  (via drill 0.35)
  Top 0.305: v113.18,29.23 113.18,29.37 113.97,30.16 113.97,31.75 115.72,33.51 X5.31
  Bottom 0.305: X5.31 107.49,34.75 105.55,36.69 105.11,36.69 104.47,37.32 104.47,37.39 J4.9 | v113.18,29.23 113.18,29.21 112.89,28.92 112.43,28.92 111.8,28.29 111.8,27.83 111.33,27.36 111.33,25.83 RN19.7
  other vias: 109.26,23.77
M109
  Top 0.305: RN16.7 112.34,35.58 X5.12
  Bottom 0.305: J4.11 104.47,42.93 104.47,42.86 104.47,40.06 105.11,39.43 106.62,39.43 109.93,36.12 X5.12 111.49,36.12
M110
  Top 0.305: RN16.8 110.37,36.38 X5.11
  Bottom 0.305: X5.11 109.7,38.89 109.5,38.69 108.94,38.69 108.74,38.89 108.54,39.09 108.54,44.61 106.64,46.5 106.01,47.14 105.71,47.14 102.72,50.13 J4.13
M111  (via drill 0.35)
  Top 0.305: v109.22,25.4 109.22,24.61 RN19.8 | X5.29 115.72,41.52 118.57,44.37 118.57,58.3 116.17,60.7 114.7,60.7 113.33,62.07 112.42,62.07 106.22,55.87 104.92,55.87 104.78,55.73 J4.15
  Bottom 0.305: X5.29 117.65,38.32 117.65,33.83 116.88,33.06 115.27,33.06 114.04,31.83 111.51,31.83 111.29,31.61 111.29,28.01 110.2,26.93 110.12,26.93 109.22,26.02 v109.22,25.4
M112  (via drill 0.35)
  Top 0.305: RN15.5 101.9,20.89 104.34,20.89 105.11,20.12 108.26,20.12 v108.97,20.83 | v114.52,47.62 113.97,48.18 113.97,50.39 112.88,51.47 X5.6
  Bottom 0.305: J4.17 104.47,59.48 104.47,59.42 105.71,58.19 106.01,58.19 111.49,52.71 X5.6 | v114.52,47.62 114.83,47.62 115.58,46.88 116.17,46.88 116.84,46.21 116.84,42.64 115.54,41.34 115.27,41.34 114.63,40.71 114.63,39.81 115.27,39.17 115.6,39.17 116.84,37.93 116.84,35.56 116.8,35.52 116.8,34.3 116.17,33.66 114.7,33.66 113.33,32.29 111.03,32.29 110.49,31.75 110.49,30.3 110.79,30 110.79,28.16 110.01,27.38 109.93,27.38 108.54,25.99 108.54,25.12 108.71,24.94 108.71,24.26 108.11,23.66 108.11,22.67 108.97,21.81 v108.97,20.83
M113  (via drill 0.35)
  Top 0.305: RN18.5 109.22,39.53 v109.22,39.37 | v117.16,52.39 115.72,53.84 X5.24
  Bottom 0.305: J4.19 104.47,65 104.47,64.93 105.11,64.3 105.41,64.3 106.64,63.06 106.64,58.46 111.17,53.93 112.04,53.93 112.19,54.08 X5.24 | v117.16,52.39 116.8,52.04 116.8,50.89 116.17,50.25 115.38,50.25 113.49,48.36 112.51,48.36 109.22,45.07 v109.22,39.37
M114  (via drill 0.35)
  Top 0.305: RN15.6 101.24,23.09 101.63,22.7 101.63,22.13 102.27,21.49 105.27,21.49 J4.21 | v117.03,48.26 116.8,48.49 | 116.8,49.02 116.8,48.49 | 116.8,48.49 116.84,48.52 116.84,51.75 115.6,52.99 115.27,52.99 114.63,53.63 114.63,53.72 X5.5
  Bottom 0.305: J4.21 106.09,21.21 109.48,17.83 111.71,17.83 112.35,18.47 113.33,18.47 113.97,19.11 113.97,23.47 115.87,25.38 116.17,25.38 116.8,26.02 116.8,27.9 116.84,27.94 116.84,30.48 118.11,31.75 118.11,47.18 v117.03,48.26
M115
  Top 0.305: J4.23 105.56,27.96 106.64,29.04 106.64,32.68 106.01,33.31 105.71,33.31 104.47,34.55 104.47,38.22 105.11,38.86 106.01,38.86 106.64,38.23 109.35,38.23 110.49,39.37 110.49,40.13 110.13,40.49 RN18.6 109.14,40.74 108.94,40.74 108.76,40.92 108.76,44.98 106,47.73 105.11,47.73 104.47,48.37 104.47,49.27 105.11,49.91 105.77,49.91 112.43,56.56 115.44,56.56 X5.23
M116  (via drill 0.35)
  Top 0.305: RN15.7 101.96,23.89 101.98,23.88 103.95,23.88 105.11,25.04 105.55,25.04 105.66,25.15 105.66,25.29 106.64,26.27 106.64,27.9 107.1,28.36 107.1,31.52 v107.33,31.75 107.33,36.68 107.97,37.31 109.73,37.31 111.4,38.99 111.4,39.37 111.4,41.24 v111.57,41.41 | v111.67,46.55 111.67,54.52 v111.76,54.61
  Bottom 0.305: v107.33,31.75 106.04,31.75 J4.25 | v111.57,41.41 111.57,46.45 v111.67,46.55 | v111.76,54.61 111.76,57.1 X5.4
M117
  Top 0.305: RN18.7 110.49,41.29 | 110.49,41.29 112.38,43.18 114.31,43.18 115.27,44.14 116.53,44.14 118.11,45.72 118.11,57.23 X5.22 | 110.49,41.29 110.49,40.78 110.95,40.32 110.95,39.18 109.54,37.77 J4.27
M118
  Top 0.305: RN15.8 102.35,26.55 103.36,26.55 104.47,27.66 104.47,31.29 103.8,31.96 103.8,34.29 | X5.3 111.98,60.99 106.41,55.41 105.11,55.41 104.47,54.78 104.47,53.18 103.17,51.88 102.87,51.88 101.6,50.61 101.6,45.72 101.63,45.69 101.63,44.23 102.27,43.59 102.57,43.59 103.8,42.36 103.8,41.46 102.57,40.23 102.27,40.23 101.63,39.59 101.63,38.14 101.6,38.1 102.25,37.46 103.17,37.46 103.79,36.83 103.8,36.83 103.8,34.29 | 103.8,34.29
M119
  Top 0.305: RN18.8 109.39,44.99 J4.31
  Bottom 0.305: X5.21 116.84,61.24 116.84,53.34 115.92,52.42 115.27,52.42 113.97,51.12 113.97,49.49 113.3,48.82 J4.31
M120  (via drill 0.35)
  Top 0.305: v57.15,25.78 57.15,26.7 RN2.5 | X2.35 51.71,23.44 v54.61,20.54 | v56.01,18.92 56.01,16.07 v56.16,15.92 | v109.22,57.15 106.4,54.33 J4.33
  Bottom 0.305: X2.35 53.67,25.78 v57.15,25.78 | v54.61,20.54 56.01,19.13 v56.01,18.92 | v56.16,15.92 58.27,13.82 58.27,9.04 60.1,7.21 72.36,7.21 78.21,13.06 124.84,13.06 129.18,17.4 129.18,31.11 128.27,32.02 128.27,39.65 125.7,42.23 125.43,42.23 124.12,43.53 124.12,45.13 123.49,45.77 123.14,45.77 117.85,51.06 117.85,61.76 116.17,63.44 115.27,63.44 114.63,62.8 114.63,61.21 112.73,59.3 112.43,59.3 110.28,57.15 v109.22,57.15
M121  (via drill 0.35)
  Top 0.305: RN1.5 57.15,21.24 57.15,20.7 56.77,20.32 55.81,20.32 55.34,19.86 50.88,19.86 49.51,21.22 48.57,21.22 46.99,22.8 46.99,23.34 X2.16 | v61.17,45.41 61.49,45.41 61.93,44.97 62.83,44.97 63.38,45.51 69.68,45.51 71.65,47.48 73.12,47.48 73.75,48.12 73.75,50.51 v74.19,50.95 | v53.34,40.64 52.8,40.1 52.8,39.93 52.16,39.3 50.12,39.3 49.32,40.1 48.42,40.1 46.79,38.47 v45.72,38.47 | v44.28,28.11 v46.99,25.4
  Bottom 0.305: J4.35 103.8,61.62 103.8,61.69 102.57,62.93 102.27,62.93 100.42,64.77 100.42,73.26 100.02,73.66 96.78,73.66 90.69,67.58 90.38,67.58 90.2,67.4 90.2,67.31 84.42,61.53 82.38,61.53 81.58,62.33 80.68,62.33 80.05,61.69 80.05,60.79 80.68,60.16 80.98,60.16 82.22,58.92 82.22,58.02 81.58,57.39 80.36,57.39 74.19,51.21 v74.19,50.95 | v61.17,45.41 60.35,45.41 59.99,45.77 58.47,45.77 v53.34,40.64 | v45.72,38.47 45.72,34.01 45.39,33.68 45.39,32.69 44.28,31.58 v44.28,28.11 | v46.99,25.4 48.7,25.4 X2.16
M122  (via drill 0.35)
  Top 0.305: RN2.6 58.24,27.54 v58.36,27.41 58.26,27.3 v58.26,24.78 | v73.66,12.7 81.28,12.7 82.07,13.49 119.46,13.49 J5.1 | v57.15,16.39 v57.15,19.05
  Bottom 0.305: v58.36,27.41 54.12,27.41 54.04,27.33 52.45,27.33 X2.34 | v57.15,16.39 57.15,16.51 60.81,12.85 62.08,12.85 63.5,11.43 68.96,11.43 70.23,12.7 v73.66,12.7 | v57.15,19.05 55.88,20.32 55.88,22.4 v58.26,24.78
M123  (via drill 0.35)
  Top 0.305: X2.15 48.87,26.76 47.79,25.67 47.79,25.4 47.67,25.29 47.67,25.12 46.48,23.93 46.48,22.1 47.81,20.77 49.32,20.77 50.69,19.4 54.84,19.4 55.18,19.05 | RN1.6 57.55,22.08 58.04,21.59 58.04,20.7 57.2,19.86 56,19.86 55.18,19.05 | 55.18,19.05 55.18,15.94 55.88,15.24 v60.96,15.24
  Bottom 0.305: J5.3 124.46,21.16 124.46,15.24 123.65,14.43 71.93,14.43 71.02,15.34 70.62,15.34 70.22,15.73 69.36,15.73 67.77,17.32 64.76,17.32 63.88,16.44 62.16,16.44 v60.96,15.24
M124  (via drill 0.35)
  Top 0.305: v58.17,28.32 57.21,28.32 RN2.7 | J5.5 121.45,26.5 121.45,19.85 116.13,14.53 77.56,14.53 76.39,15.7 76.07,15.7 75.85,15.92 75.01,15.92 71.79,12.7 | 71.79,12.7 71.69,12.6 | 71.79,12.7 v63.5,12.7 | v64.84,16.44 64.71,16.57 v64.71,19.63 | v50.18,22.85 50.18,27.32 v50.72,27.86
  Bottom 0.305: v58.17,28.32 54.38,28.32 53.85,27.79 53.28,27.79 X2.33 51.71,28.85 v50.72,27.86 | v63.5,12.7 63.5,15.1 v64.84,16.44 | v64.71,19.63 64.6,19.52 60.79,19.52 59.99,18.72 57.79,18.72 57.05,17.98 54.61,17.98 52.6,20 51.26,20 50.18,21.08 v50.18,22.85
M125  (via drill 0.35)
  Top 0.305: v53.57,28.47 53.34,28.24 53.34,26.29 54.86,24.76 55.76,24.76 56.47,24.05 56.47,23.39 56.74,23.12 56.95,23.12 RN1.7 57.21,22.86 57.91,22.86 58.42,22.35 58.42,21.86 58.55,21.72 58.55,20.36 58.45,20.26 58.45,16.16 58.63,15.99 61.18,15.99 62.26,14.91 68.71,14.91 v68.83,15.03
  Bottom 0.305: v53.57,28.47 52.8,29.24 52.8,29.81 51.88,30.73 X2.14 | v68.83,15.03 69.81,14.06 71.21,14.06 | 71.21,14.06 71.3,13.97 | J5.7 124.8,31.88 124.8,31.78 125.43,31.14 126.33,31.14 128.27,29.21 128.27,17.78 124.46,13.97 71.74,13.97 71.66,14.06 71.21,14.06
M126  (via drill 0.35)
  Top 0.305: v56,30.15 56.18,30.15 RN2.8 56.95,28.89 56.74,28.89 56.56,28.72 56.56,26.16 56.47,26.06 56.47,25.5 57.92,24.05 59.61,24.05 60.62,23.03 60.62,18.67 61.08,18.21 61.08,17.57 63.28,15.37 67.06,15.37 v67.44,15.75
  Bottom 0.305: X2.32 54.05,32.1 v56,30.15 | J5.9 123.04,37.9 124.12,36.82 124.12,35.22 126.03,33.31 126.33,33.31 128.73,30.92 128.73,17.59 124.65,13.51 69.67,13.51 69.53,13.65 68.9,13.65 67.44,15.11 v67.44,15.75
M127  (via drill 0.35)
  Top 0.305: X2.13 50.63,31.75 50.63,31.65 51.26,31.02 52.16,31.02 52.27,31.13 v53.03,31.13 | v54.22,29.13 54.35,29 54.35,26.82 56.93,24.24 56.93,23.94 RN1.8 57.64,23.68 57.73,23.59 58.15,23.59 v58.42,23.32 | J5.11 124.8,42.93 124.8,42.86 126.06,41.59 126.33,41.59 127,40.92 127,20.32 126.2,19.52 125.43,19.52 124.06,18.16 122.13,18.16 117.95,13.97 77.47,13.97 76.2,15.24 v75.56,15.24 | v70.9,16.02 70.9,16.35 70.91,16.37 70.91,20 70.28,20.64 68.9,20.64 67.77,19.51 66.45,19.51 65.18,20.77 64.12,20.77 63.58,20.24 v63.26,20.24
  Bottom 0.305: v53.03,31.13 54.22,29.93 v54.22,29.13 | v75.56,15.24 71.77,15.24 71.21,15.79 71.12,15.79 v70.9,16.02 | v63.26,20.24 62.94,20.24 62.83,20.12 61.93,20.12 60.56,21.49 59.09,21.49 58.45,22.13 58.45,23.28 v58.42,23.32
VCC  (via drill 0.35)  (2 unrouted)
  Top 0.305: 54.61,37.58 54.61,37.51 | v54.23,35.27 54.56,35.61 55.05,35.61 55.06,35.62 RN4.1 | RN6.4 28.84,25.47 v28.62,25.68
  Bottom 0.305: 11.83,5.08 U$1.1 | v28.62,25.68 27.07,24.13 v26.67,24.13 | v54.23,35.27 53.34,36.16 v53.34,37.51 | v26.67,43.18 27.94,43.18 v30.48,45.72 | v72.77,67.56 72.77,70.23 v74.42,71.88 | v111.51,19.05 109.47,19.05 v107.06,21.46 | v87.5,25.91 87.5,27.81 v88.9,29.21 89.19,28.92 91.74,28.92 91.83,28.83 v92.2,28.83 | v96.9,41.91 96.9,39.07 96.79,38.96 96.79,36.31 v97.03,36.07 | v97.79,24.13 96.27,25.65 v96.27,27.18 | v98.81,17.14 97.03,17.14 v95.76,15.88 | v119.63,16.89 117.22,16.89 v117.09,17.02 | v111.76,59.69 110.49,60.96 v110.49,62.23
  pour Top: -2.54,87.63 132.08,87.63 132.08,-2.54 -2.54,-2.54

### Text on the board
tPlace: Justin Bracks / Juzz@sas.upenn.edu
tNames: M57 | M76 | M95 | M113 | FIO6 | NC | NC | NC | NC | RTN | RTN | RTN | RTN | RTN | FIO5 | DAC1 | RTN | RTN | RTN | RTN | RTN | DAC0 | M57 | NC | RTN | RTN | FIO5 | FIO4 | FIO3 | FIO2 | FIO1 | FIO0 | M58 | RTN | RTN | M48 | RTN | M58 | M77 | M96 | M114 | RTN | 5V In | RTN | RTN | RTN | RTN | RTN | RTN | RTN | RTN | RTN | FIO7 | M48 | M67 | M86 | M104 | M122